# Altium schematic sheet 04 - BUTTON.SchDoc
size A; SheetNumber: 3; SheetTotal: 4
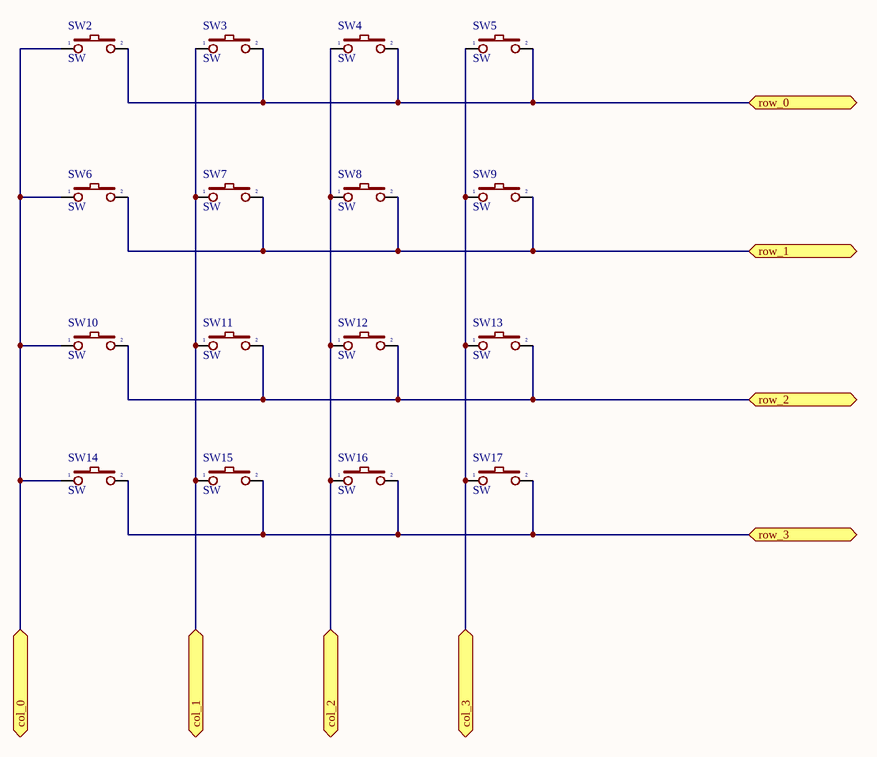
[diagram p0: 04 - BUTTON.SchDoc]

## Parts
SW2  SW  [SW2]
SW3  SW  [SW2]
SW4  SW  [SW2]
SW5  SW  [SW2]
SW6  SW  [SW2]
SW7  SW  [SW2]
SW8  SW  [SW2]
SW9  SW  [SW2]
SW10  SW  [SW2]
SW11  SW  [SW2]
SW12  SW  [SW2]
SW13  SW  [SW2]
SW14  SW  [SW2]
SW15  SW  [SW2]
SW16  SW  [SW2]
SW17  SW  [SW2]

## Ports
col_0 (bidir), col_1 (bidir), col_2 (bidir), col_3 (bidir), row_0 (bidir), row_1 (bidir), row_2 (bidir), row_3 (bidir)

## Nets
col_0: SW2.1 SW6.1 SW10.1 SW14.1 ; port col_0
col_1: SW3.1 SW7.1 SW11.1 SW15.1 ; port col_1
col_2: SW4.1 SW8.1 SW12.1 SW16.1 ; port col_2
col_3: SW5.1 SW9.1 SW13.1 SW17.1 ; port col_3
row_0: SW2.2 SW3.2 SW4.2 SW5.2 ; port row_0
row_1: SW6.2 SW7.2 SW8.2 SW9.2 ; port row_1
row_2: SW10.2 SW11.2 SW12.2 SW13.2 ; port row_2
row_3: SW14.2 SW15.2 SW16.2 SW17.2 ; port row_3

## Library data of the parts
SW2-SW17 = SW2: Switch button 2 pin; Value: SW chip 2 pin